# Altium project 4-digit_7-segment-LED.PrjPcb
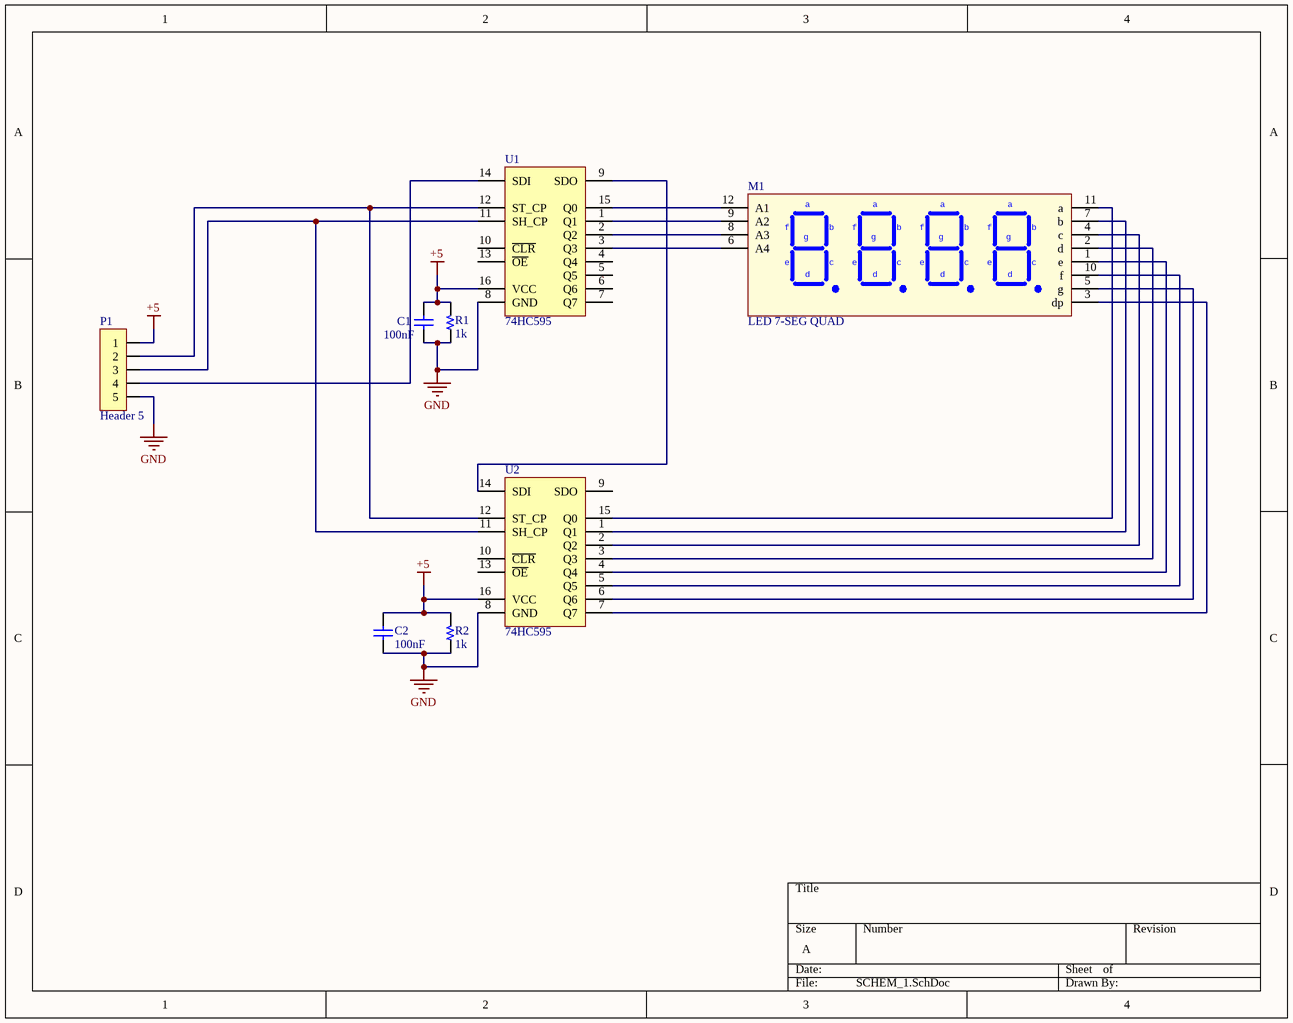
[diagram p0: SCHEM_1.SchDoc]
1 sheet, 8 parts. Net scope: global (net labels, ports and power ports of the same name join across sheets).
Board file: PCB_1.PcbDoc

## Sheet SCHEM_1.SchDoc
size A

### Parts
C1  100nF  [C 1210]
C2  100nF  [C 1210]
M1  LED 7-SEG QUAD  [LED/7SEG/0.56/QUAD]
P1  Header 5  [HDR/Header/5]
R1  1k  [R 1210]
R2  1k  [R 1210]
U1  74HC595  [SOIC-16]
U2  74HC595  [SOIC-16]

### Nets
+5: C1.1 C2.1 P1.1 R1.2 R2.2 U1.16(VCC) U2.16(VCC)
GND: C1.2 C2.2 P1.5 R1.1 R2.1 U1.8(GND) U2.8(GND)
NetM1_1: M1.1(e) U2.4(Q4)
NetM1_2: M1.2(d) U2.3(Q3)
NetM1_3: M1.3(dp) U2.7(Q7)
NetM1_4: M1.4(c) U2.2(Q2)
NetM1_5: M1.5(g) U2.6(Q6)
NetM1_6: M1.6(A4) U1.3(Q3)
NetM1_7: M1.7(b) U2.1(Q1)
NetM1_8: M1.8(A3) U1.2(Q2)
NetM1_9: M1.9(A2) U1.1(Q1)
NetM1_10: M1.10(f) U2.5(Q5)
NetM1_11: M1.11(a) U2.15(Q0)
NetM1_12: M1.12(A1) U1.15(Q0)
NetP1_2: P1.2 U1.12(ST_CP) U2.12(ST_CP)
NetP1_3: P1.3 U1.11(SH_CP) U2.11(SH_CP)
NetP1_4: P1.4 U1.14(SDI)
NetU1_9: U1.9(SDO) U2.14(SDI)

Not connected (* = marked no-connect by the designer): U1 4(Q4) 5(Q5) 6(Q6) 7(Q7) 10(~{CLR}) 13(~{OE}); U2 9(SDO) 10(~{CLR}) 13(~{OE})

### Library data of the parts
C1 C2 = Capacitor NP: Capacitor non-pol
M1 = LED 7-SEG QUAD: LED 7-SEG 0.56 QUAD RED
P1 = Header 5: Header, 5-Pin
R1 R2 = Resistor
U1 U2 = 74HC595: 8-bit serial-in, serial or parallel-out  shift register with output latches;  3-state